# Altium schematic sheet ESC-Schematic.SchDoc
size A2; SheetNumber: 1; SheetTotal: 1
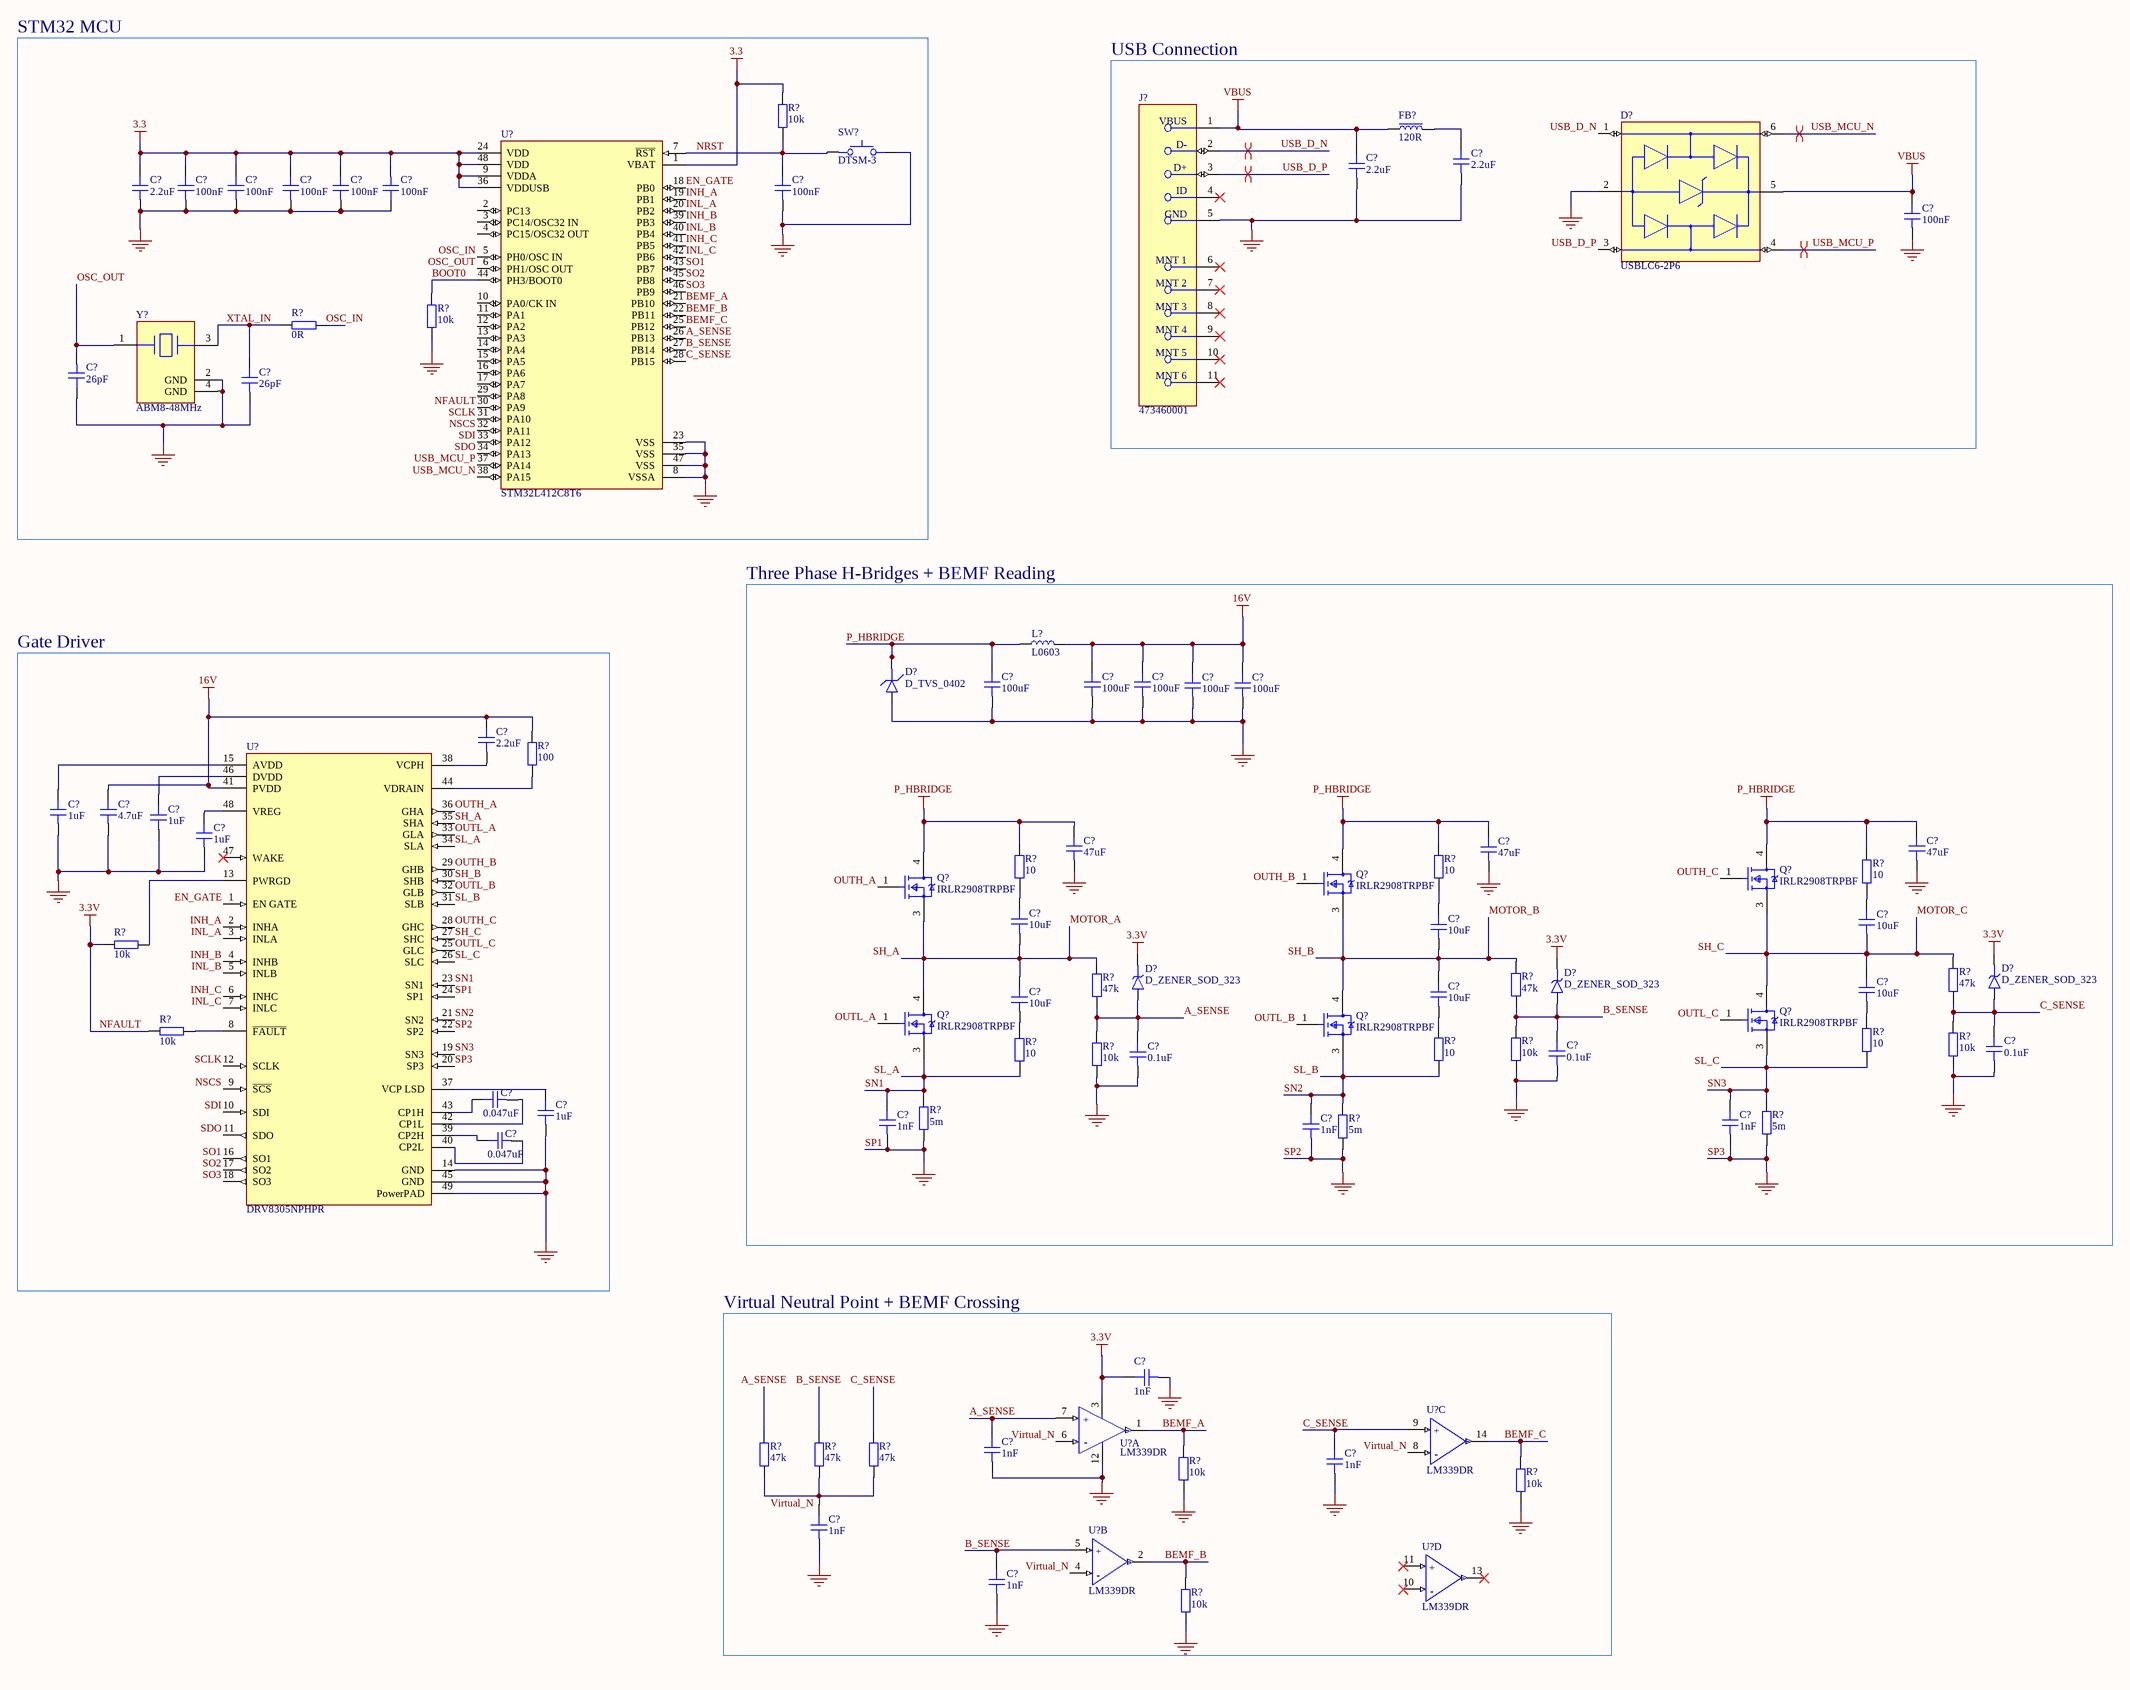
[diagram p0: ESC-Schematic.SchDoc]

## Parts
(Parts that share a designator on the sheet are numbered #1, #2 ... from top to bottom, then left to right.)
C?#1  2.2uF  [CAP_0603]
C?#2  2.2uF  [CAP_0603]
C?#3  2.2uF  [CAP_0603]
C?#4  100nF  [CAP_0402]
C?#5  100nF  [CAP_0402]
C?#6  100nF  [CAP_0402]
C?#7  100nF  [CAP_0402]
C?#8  100nF  [CAP_0402]
C?#9  100nF  [CAP_0402]
C?#10  100nF  [CAP_0402]
C?#11  26pF  [CAP_0402]
C?#12  26pF  [CAP_0402]
C?#13  100uF  [CAP_0805]
C?#14  100uF  [CAP_0805]
C?#15  100uF  [CAP_0805]
C?#16  100uF  [CAP_0805]
C?#17  100uF  [CAP_0805]
C?#18  2.2uF  [CAP_0402]
C?#19  1uF  [CAP_0402]
C?#20  4.7uF  [CAP_0402]
C?#21  1uF  [CAP_0402]
C?#22  1uF  [CAP_0402]
C?#23  47uF  [CAP_0402]
C?#24  47uF  [CAP_0402]
C?#25  47uF  [CAP_0402]
C?#26  10uF  [CAP_0402]
C?#27  10uF  [CAP_0402]
C?#28  10uF  [CAP_0402]
C?#29  10uF  [CAP_0402]
C?#30  10uF  [CAP_0402]
C?#31  10uF  [CAP_0402]
C?#32  0.1uF  [CAP_0402]
C?#33  0.1uF  [CAP_0402]
C?#34  0.1uF  [CAP_0402]
C?#35  0.047uF  [CAP_0402]
C?#36  1uF  [CAP_0402]
C?#37  1nF  [CAP_0402]
C?#38  1nF  [CAP_0402]
C?#39  1nF  [CAP_0402]
C?#40  0.047uF  [CAP_0402]
C?#41  1nF  [CAP_0402]
C?#42  1nF  [CAP_0402]
C?#43  1nF  [CAP_0402]
C?#44  1nF  [CAP_0402]
C?#45  1nF  [CAP_0402]
D?#1  USBLC6-2P6  [FP-SOT-666-MFG]
D?#2  D_TVS_0402  [D_0402]
D?#3  D_ZENER_SOD_323  [SOD-323]
D?#4  D_ZENER_SOD_323  [SOD-323]
D?#5  D_ZENER_SOD_323  [SOD-323]
FB?  120R  [FB_0603]
J?  473460001  [FP-473460001-MFG]
L?  L0603  [IND_0603]
Q?#1  IRLR2908TRPBF  [FP-PG-TO252-3-MFG]
Q?#2  IRLR2908TRPBF  [FP-PG-TO252-3-MFG]
Q?#3  IRLR2908TRPBF  [FP-PG-TO252-3-MFG]
Q?#4  IRLR2908TRPBF  [FP-PG-TO252-3-MFG]
Q?#5  IRLR2908TRPBF  [FP-PG-TO252-3-MFG]
Q?#6  IRLR2908TRPBF  [FP-PG-TO252-3-MFG]
R?#1  10k  [RES_0402]
R?#2  10k  [RES_0402]
R?#3  0R  [RES_0402]
R?#4  100  [RES_0402]
R?#5  10  [RES_0402]
R?#6  10  [RES_0402]
R?#7  10  [RES_0402]
R?#8  10k  [RES_0402]
R?#9  47k  [RES_0402]
R?#10  47k  [RES_0402]
R?#11  47k  [RES_0402]
R?#12  10k  [RES_0402]
R?#13  10  [RES_0402]
R?#14  10  [RES_0402]
R?#15  10k  [RES_0402]
R?#16  10k  [RES_0402]
R?#17  10  [RES_0402]
R?#18  10k  [RES_0402]
R?#19  5m  [RES_0402]
R?#20  5m  [RES_0402]
R?#21  5m  [RES_0402]
R?#22  47k  [RES_0402]
R?#23  47k  [RES_0402]
R?#24  47k  [RES_0402]
R?#25  10k  [RES_0402]
R?#26  10k  [RES_0402]
R?#27  10k  [RES_0402]
SW?  DTSM-3  [DTSM-3]
U?#1  STM32L412C8T6  [FP-LQFP48-5B-MFG]
U?#2  DRV8305NPHPR  [FP-PHP0048G-IPC_A]
U?#3  LM339DR  [FP-D0014A-MFG]  (part A of 4)
U?#4  LM339DR  [FP-D0014A-MFG]  (part C of 4)
U?#5  LM339DR  [FP-D0014A-MFG]  (part B of 4)
U?#6  LM339DR  [FP-D0014A-MFG]  (part D of 4)
Y?  ABM8-48MHz  [FP-ABM8-MFG]

## Blocks framed on the sheet
STM32 MCU: C?#3-C?#9 C?#11 C?#12 R?#1-R?#3 SW? U?#1 Y?
USB Connection: C?#1 C?#2 C?#10 D?#1 FB? J?
Three Phase H-Bridges + BEMF Reading: C?#13-C?#17 C?#23-C?#34 C?#37-C?#39 D?#2-D?#5 L? Q?#1-Q?#6 R?#5-R?#7 R?#9-R?#11 R?#13-R?#21
Gate Driver: C?#18-C?#22 C?#35 C?#36 C?#40 R?#4 R?#8 R?#12 U?#2
Virtual Neutral Point + BEMF Crossing: C?#41-C?#45 R?#22-R?#27 U?#3-U?#6

## Nets
3.3: C?#3.2 C?#4.2 C?#5.2 C?#6.2 C?#7.2 C?#8.1 R?#1.2 U?#1.1(VBAT) U?#1.9(VDDA) U?#1.24(VDD) U?#1.36(VDDUSB) U?#1.48(VDD)
16V: C?#14.2 C?#15.2 C?#16.2 C?#17.2 C?#18.2 C?#20.2 L?.2 R?#4.2 U?#2.41(PVDD)
NFAULT: C?#41.2 D?#3.K D?#4.K D?#5.K R?#8.2 R?#12.2 U?#1.30(PA9) U?#3.3(VCC)  [also labelled 3.3V]
P_HBRIDGE: C?#13.2 C?#23.2 C?#24.2 C?#25.2 D?#2.K L?.1 Q?#1.4(D) Q?#2.4(D) Q?#3.4(D) R?#5.2 R?#6.2 R?#7.2
SP1: C?#1.1 C?#2.1 C?#3.1 C?#4.1 C?#5.1 C?#6.1 C?#7.1 C?#8.2 C?#9.1 C?#11.2 C?#12.1 C?#13.1 C?#14.1 C?#15.1 C?#16.1 C?#17.1 C?#19.1 C?#20.1 C?#21.1 C?#22.1 C?#23.1 C?#24.1 C?#25.1 C?#32.1 C?#33.1 C?#34.1 C?#36.1 C?#37.1 C?#38.1 C?#39.1 C?#41.1 C?#42.1 C?#43.1 C?#44.1 C?#45.1 D?#1.2(GND) J?.5(GND) R?#2.1 R?#15.1 R?#16.1 R?#18.1 R?#19.1 R?#20.1 R?#21.1 R?#25.1 R?#26.1 R?#27.1 SW?.2 U?#1.8(VSSA) U?#1.23(VSS) U?#1.35(VSS) U?#1.47(VSS) U?#2.14(GND) U?#2.20(SP3) U?#2.22(SP2) U?#2.24(SP1) U?#2.45(GND) U?#2.49(PowerPAD) U?#3.12(GND) Y?.2(GND) Y?.4(GND)  [also labelled GND, SP2, SP3]
VBUS: C?#2.2 C?#10.2 D?#1.5(VBUS) FB?.1 J?.1(VBUS)
A_SENSE: C?#33.2 C?#42.2 D?#3.A R?#10.1 R?#18.2 R?#22.2 U?#1.26(PB13) U?#3.7(1IN+)
B_SENSE: C?#34.2 C?#45.2 D?#5.A R?#11.1 R?#15.2 R?#23.2 U?#1.27(PB14) U?#5.5(2IN+)
BEMF_A: R?#25.2 U?#1.21(PB10) U?#3.1(1OUT)
BEMF_B: R?#27.2 U?#1.22(PB11) U?#5.2(2OUT)
BEMF_C: R?#26.2 U?#1.25(PB12) U?#4.14(OUT3)
BOOT0: R?#2.2 U?#1.44(PH3/BOOT0)
C_SENSE: C?#32.2 C?#43.2 D?#4.A R?#9.1 R?#16.2 R?#24.2 U?#1.28(PB15) U?#4.9(3IN+)
EN_GATE: U?#1.18(PB0) U?#2.1(EN_GATE)
INH_A: U?#1.19(PB1) U?#2.2(INHA)
INH_B: U?#1.39(PB3) U?#2.4(INHB)
INH_C: U?#1.41(PB5) U?#2.6(INHC)
INL_A: U?#1.20(PB2) U?#2.3(INLA)
INL_B: U?#1.40(PB4) U?#2.5(INLB)
INL_C: U?#1.42(PB6) U?#2.7(INLC)
MOTOR_A: C?#26.1 C?#31.2 Q?#2.3(S) Q?#5.4(D) R?#10.2 U?#2.35(SHA)  [also labelled SH_A]
MOTOR_B: C?#28.1 C?#30.2 Q?#3.3(S) Q?#6.4(D) R?#11.2 U?#2.30(SHB)  [also labelled SH_B]
MOTOR_C: C?#27.1 C?#29.2 Q?#1.3(S) Q?#4.4(D) R?#9.2 U?#2.27(SHC)  [also labelled SH_C]
NRST: C?#9.2 R?#1.1 SW?.1 U?#1.7(~{RST})
NSCS: U?#1.32(PA11) U?#2.9(~{SCS})
OSC_IN: R?#3.2 U?#1.5(PH0/OSC_IN)
OSC_OUT: C?#11.1 U?#1.6(PH1/OSC_OUT) Y?.1
OUTH_A: Q?#2.1(G) U?#2.36(GHA)
OUTH_B: Q?#3.1(G) U?#2.29(GHB)
OUTH_C: Q?#1.1(G) U?#2.28(GHC)
OUTL_A: Q?#5.1(G) U?#2.33(GLA)
OUTL_B: Q?#6.1(G) U?#2.32(GLB)
OUTL_C: Q?#4.1(G) U?#2.25(GLC)
SCLK: U?#1.31(PA10) U?#2.12(SCLK)
SDI: U?#1.33(PA12) U?#2.10(SDI)
SDO: U?#1.34(PA13) U?#2.11(SDO)
SL_A: C?#37.2 Q?#5.3(S) R?#17.1 R?#19.2 U?#2.23(SN1) U?#2.34(SLA)  [also labelled SN1]
SL_B: C?#39.2 Q?#6.3(S) R?#14.1 R?#21.2 U?#2.21(SN2) U?#2.31(SLB)  [also labelled SN2]
SL_C: C?#38.2 Q?#4.3(S) R?#13.1 R?#20.2 U?#2.19(SN3) U?#2.26(SLC)  [also labelled SN3]
SO1: U?#1.43(PB7) U?#2.16(SO1)
SO2: U?#1.45(PB8) U?#2.17(SO2)
SO3: U?#1.46(PB9) U?#2.18(SO3)
USB_D_N: D?#1.1(I/O1) J?.2(D-)
USB_D_P: D?#1.3(I/O2) J?.3(D+)
USB_MCU_N: D?#1.6(I/O1) U?#1.38(PA15)
USB_MCU_P: D?#1.4(I/O2) U?#1.37(PA14)
Virtual_N: C?#44.2 R?#22.1 R?#23.1 R?#24.1 U?#3.6(1IN-) U?#4.8(3IN-) U?#5.4(2IN-)
XTAL_IN: C?#12.2 R?#3.1 Y?.3
NetC?#1_2: C?#1.2 FB?.2
NetC?#18_1: C?#18.1 U?#2.38(VCPH)
NetC?#19_2: C?#19.2 U?#2.15(AVDD)
NetC?#21_2: C?#21.2 U?#2.46(DVDD)
NetC?#22_2: C?#22.2 U?#2.48(VREG)
NetC?#26_2: C?#26.2 R?#5.1
NetC?#27_2: C?#27.2 R?#7.1
NetC?#29_1: C?#29.1 R?#13.2
NetC?#30_1: C?#30.1 R?#14.2
NetC?#31_1: C?#31.1 R?#17.2
NetC?#35_1: C?#35.1 U?#2.42(CP1L)
NetC?#35_2: C?#35.2 U?#2.43(CP1H)
NetC?#36_2: C?#36.2 U?#2.37(VCP_LSD)
NetC?#40_1: C?#40.1 U?#2.40(CP2L)
NetC?#40_2: C?#40.2 U?#2.39(CP2H)
NetR?#4_1: R?#4.1 U?#2.44(VDRAIN)
NetR?#8_1: R?#8.1 U?#2.13(PWRGD)
NetR?#12_1: R?#12.1 U?#2.8(~{FAULT})

Not connected (* = marked no-connect by the designer): C?#10 1; C?#28 2; D?#2 A; J? 4(ID)* 6(MNT_1)* 7(MNT_2)* 8(MNT_3)* 9(MNT_4)* 10(MNT_5)* 11(MNT_6)*; R?#6 1; U?#1 2(PC13) 3(PC14/OSC32_IN) 4(PC15/OSC32_OUT) 10(PA0/CK_IN) 11(PA1) 12(PA2) 13(PA3) 14(PA4) 15(PA5) 16(PA6) 17(PA7) 29(PA8); U?#2 47(WAKE)*; U?#6 10(4IN-)* 11(4IN+)* 13(OUT4)*

## Layout directives
differential pair; differential pair class DIFF_USB_O: USB_D_N, USB_D_P
differential pair; differential pair class DIFF_USB_MCU: USB_MCU_N, USB_MCU_P

## Notes on the sheet
- Labels drawn without touching a wire or pin: GND
- (in symbol CMP-04896-000028-1, part A) +; -
- (in symbol CMP-04896-000028-1, part B) +; -
- (in symbol CMP-04896-000028-1, part C) +; -
- (in symbol CMP-04896-000028-1, part D) +; -

## Library data of the parts
C?#1-C?#3 = CAP_0603: Capacitor SMD 0603; Manufacturer: *; Manufacturer Part Number: *; Distributor Link: *; LCSC: *; Rating: *; Dielectric: *
C?#4-C?#12 C?#18-C?#45 = CAP_0402: Capacitor SMD 0402; Manufacturer: *; Manufacturer Part Number: *; Distributor Link: *; LCSC: *; Rating: *; Dielectric: *
C?#13-C?#17 = CAP_0805: Capacitor SMD 0805; Manufacturer: *; Manufacturer Part Number: *; Distributor Link: *; LCSC: *; Rating: *; Dielectric: *
D?#1 = CMP-12225-000058-1: TVS DIODE 5.25V 17V SOT666; Min Breakdown Voltage: 6V; Power Line Protection: Yes; Element Configuration: Dual; Test Current: 1mA; Working Voltage: 5V; Number of Channels: 2; Max Reverse Leakage Current: 150nA; Direction: Unidirectional; Peak Pulse Current: 5A; Number of Elements: 1; Capacitance: 3.5pF; Max Breakdown Voltage: 6V; Height: 0.6mm; Depth: 1.3mm; Contact Plating: Tin; Reverse Breakdown Voltage: 6V; REACH SVHC: No SVHC; Operating Supply Voltage: 5V; Width: 1.3mm; Max Operating Temperature: 125°C; Reverse Standoff Voltage: 5V; ESD Protection: Yes; Package Quantity: 1; Termination: SMD/SMT; Length: 1.7mm; Leakage Current: 150nA; Number of Bidirectional Channels: 2; Case/Package: SOT-666; Min Operating Temperature: -40°C; Number of Pins: 6; Clamping Voltage: 17V; Breakdown Voltage: 6V; Lead Free: Lead Free; Radiation Hardening: No; Packaging: Tape and Reel; Mount: Surface Mount; Polarity: Unidirectional
D?#2 = D_TVS_0402: Diode TVS / ESD 0402
D?#3-D?#5 = D_ZENER_SOD_323: Diode Zener SMD SOD-323
FB? = FB_0603: Ferrite Bead SMD 0603; Manufacturer: *; Manufacturer Part Number: *; Distributor Link: *; LCSC: *
J? = CMP-2000-05246-2: CONN RCPT USB2.0 MICRO B SMD R/A; Manufacturer: Molex; Conn Orientation: Right Angle; Is Female: yes; Shielding: true; Pitch: 0.65mm; Number Of Contacts: 5; Voltage Rating: 30V; Current Rating: 1.8A; Device Class L2: USB Connectors; Digikey Description: CONN RCPT USB2.0 MICRO B SMD R/A; Height: 2.945mm; RoHS: TRUE; ComponentLink2Description: Datasheet; Octopart: https://octopart.com/47346-0001-molex-7164928; Automotive: No; Package: 0; Category: Conn; Device Class L1: Connectors; Usb Standard: USB 2.0; Temperature: -30°C to +85°C; Temperature Range Low: -30°C; Footprint Url: https://www.molex.com/pdm_docs/sd/473460001_sd.pdf; ComponentLink2URL: https://www.molex.com/webdocs/datasheets/pdf/en-us/0473460001_IO_CONNECTORS.pdf; Lead Free: Yes; Manufacturer Part Number: 473460001; Contact Material: Gold,Nickel; Temperature Range High: +85°C; Device Class L3: unset
L? = IND_0603: Inductor SMD 0603
Q?#1-Q?#6 = CMP-32901-000047-1: MOSFET N-CH 80V 30A DPAK; Manufacturer: Infineon; Turn On Delay Time: 12ns; Threshold Vgs Max: 2.5V; Power Dissipation: 120W; Max Forward Diode Voltage: 1.3V; Reverse Recovery Charge: 210nC; Max Junction Temp: +175°C; Number Of N Channels: 1; Drain To Source Resistance: 22.5mΩ; Depletion Mode: False; Reverse Recovery Time: 75ns; Turn Off Delay Time: 36ns; Gate To Source Voltage: 16V; Pulse Drain Current: 150A; Input Capacitace At Vds: 1890pF @ 25V; Gate Charge At Vgs: 22nC @ 4.5V; Threshold Vgs Min: 1V; Rthja Max: 40°C/W; Manufacturer Part Number: IRLR2908TRPBF; Drain To Source Breakdown Voltage: 80V; Device Class L2: Transistors; Continuous Drain Current: 30A; Lead Free: Yes; RoHS: TRUE; Category: Trans; Octopart: https://octopart.com/irlr2908trpbf-infineon-65875019; Height: 2.52mm; Number Of Channels: 1; Footprint Url: https://www.infineon.com/dgdl/po-dpak.pdf?fileId=5546d462580663ef0158068dbd7a01d5; Temperature Range Low: -55°C; Automotive: No; Temperature Range High: +175°C; Device Class L3: MOSFETs; Device Class L1: Discrete Semiconductors; Drain To Source Voltage: 80V; ComponentLink2Description: Datasheet; Digikey Description: MOSFET N-CH 80V 30A DPAK; Temperature: -55°C to +175°C; ComponentLink2URL: https://www.infineon.com/dgdl/irlr2908pbf.pdf?fileId=5546d462533600a40153566cdace2681; Package: PG-TO252-3
R?#1-R?#27 = RES_0402: Resistor SMD 0402; Manufacturer: *; Manufacturer Part Number: *; Distributor Link: *; LCSC: *
SW? = DTSM-3: Tactile Switch SMD SPST; Manufacturer: Diptronics; Manufacturer Part Number: DTSM-3
U?#1 = CMP-12105-000105-1: IC MCU 32BIT 64KB FLASH 48LQFP; RoHS Compliant: Yes
U?#2 = CMP-04915-000026-1: IC MTR DRV MULTI 4.4-45V 48HTQFP; Number of Outputs: 1; Output Current: 80mA; Channel Type: 3-Phase; Min Supply Voltage: 4.4V; Number of Drivers: 6; Max Supply Voltage: 45V; Max Output Current: 1A; Max Operating Temperature: 125°C; Number of Pins: 48; Packaging: Cut Tape; Mount: Surface Mount; Min Operating Temperature: -40°C; REACH SVHC: No SVHC; Type: Integrated Circuit (IC); RoHS Compliant: Yes; Lead Free: Lead Free
U?#3-U?#6 = CMP-04896-000028-1: IC QUAD DIFF COMP 14-SOIC; Manufacturer: Texas Instruments; Nominal Supply Current: 0.8mA; Min Dual Supply Voltage: 1V; Number Of Channels: 4; Input Offset Voltage: 2mV; Max Junction Temp: +70°C; Min Supply Voltage: 2V; Response Time: 1.3us; Max Dual Supply Voltage: 18V; Max Supply Voltage: 30V; Standoff Height: 0.1mm; Input Bias Current: -0.025uA; Output Current Per Channel: 6mA; Category: IC; Octopart: https://octopart.com/lm339dr-texas+instruments-45532; Automotive: No; Temperature: 0°C to +70°C; Ipc Land Pattern Name: SOIC127P600X175-14; Temperature Range Low: 0°C; Mouser Description: Analog Comparators Quad Differential; Lead Free: Yes; Digikey Description: IC QUAD DIFF COMP 14-SOIC; ComponentLink2URL: http://www.ti.com/lit/ds/symlink/lm339.pdf; Device Class L3: Comparators; Manufacturer Part Number: LM339DR; Temperature Range High: +70°C; Device Class L2: Linear ICs; Height: 1.75mm; Device Class L1: Integrated Circuits (ICs); Package: D0014A; RoHS: TRUE; ComponentLink2Description: Datasheet
Y? = CMP-27762-011708-1: Crystal 48MHz ±20ppm 18pF SMD-4 3.2mm x 2.5mm; Series Resistance: 35R; Frequency Stability: 50ppm; Package Quantity: 1000; Packaging: Tape and Reel; Mount: Surface Mount; Length: 3.2mm; Load Capacitance: 18pF; Max Operating Temperature: 70°C; Operating Frequency: 48 MHz; RoHS Compliant: Yes; Series: ABM8; Frequency Tolerance: 20ppm; Lead Free: Lead Free; Min Operating Temperature: -20°C; Case/Package: CSMD; Number of Pins: 4; Height: 0.031inch; ESR (Equivalent Series Resistance): 35R; Frequency: 48MHz; Radiation Hardening: No; Width: 0.098inch; Tolerance: 20ppm; Termination: SMD/SMT; Depth: 2.5mm; Resistor Type: Ceramic; REACH SVHC: No SVHC